# EAGLE design msp430g2955 (EAGLE 7.3.0)
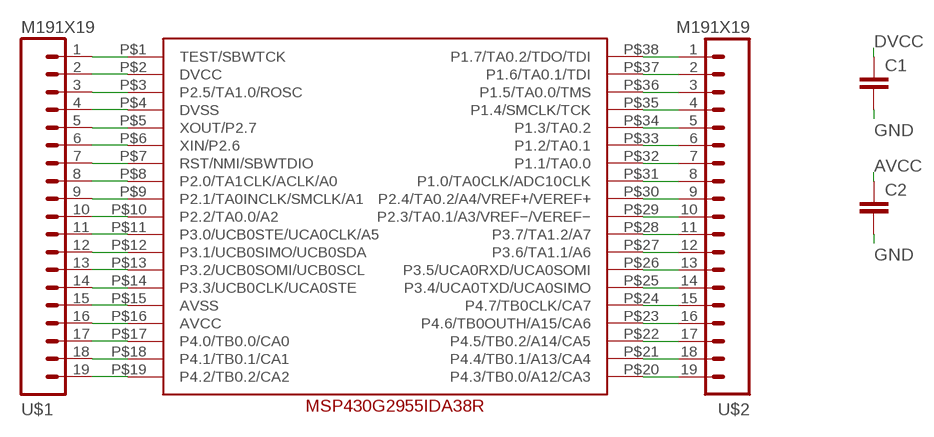
[diagram p0: schematic, sheet 1]

## Parts
C1  C-EUC0805  [C0805]
C2  C-EUC0805  [C0805]
U$1  M191X19  [1X19]
U$2  M191X19  [1X19]
U$3  MSP430G2955IDA38R  [MSP430G2955IDA38R]

## Nets
AVCC: C2.1 U$1.16 U$3.P$16(AVCC)
DVCC: C1.1 U$1.2 U$3.P$2(DVCC)
GND: C1.2 C2.2 U$1.4 U$1.15 U$3.P$4(DVSS) U$3.P$15(AVSS)
N$1: U$1.1 U$3.P$1(TEST/SBWTCK)
N$3: U$1.3 U$3.P$3(P2.5/TA1.0/ROSC)
N$5: U$1.5 U$3.P$5(XOUT/P2.7)
N$6: U$1.6 U$3.P$6(XIN/P2.6)
N$7: U$1.7 U$3.P$7(RST/NMI/SBWTDIO)
N$8: U$1.8 U$3.P$8(P2.0/TA1CLK/ACLK/A0)
N$9: U$1.9 U$3.P$9(P2.1/TA0INCLK/SMCLK/A1)
N$10: U$1.10 U$3.P$10(P2.2/TA0.0/A2)
N$11: U$1.11 U$3.P$11(P3.0/UCB0STE/UCA0CLK/A5)
N$12: U$1.12 U$3.P$12(P3.1/UCB0SIMO/UCB0SDA)
N$13: U$1.13 U$3.P$13(P3.2/UCB0SOMI/UCB0SCL)
N$14: U$1.14 U$3.P$14(P3.3/UCB0CLK/UCA0STE)
N$17: U$1.17 U$3.P$17(P4.0/TB0.0/CA0)
N$18: U$1.18 U$3.P$18(P4.1/TB0.1/CA1)
N$19: U$1.19 U$3.P$19(P4.2/TB0.2/CA2)
N$20: U$2.19 U$3.P$20(P4.3/TB0.0/A12/CA3)
N$21: U$2.18 U$3.P$21(P4.4/TB0.1/A13/CA4)
N$22: U$2.17 U$3.P$22(P4.5/TB0.2/A14/CA5)
N$23: U$2.16 U$3.P$23(P4.6/TB0OUTH/A15/CA6)
N$24: U$2.15 U$3.P$24(P4.7/TB0CLK/CA7)
N$25: U$2.14 U$3.P$25(P3.4/UCA0TXD/UCA0SIMO)
N$26: U$2.13 U$3.P$26(P3.5/UCA0RXD/UCA0SOMI)
N$27: U$2.12 U$3.P$27(P3.6/TA1.1/A6)
N$28: U$2.11 U$3.P$28(P3.7/TA1.2/A7)
N$29: U$2.10 U$3.P$29(P2.3/TA0.1/A3/VREF−/VEREF−)
N$30: U$2.9 U$3.P$30(P2.4/TA0.2/A4/VREF+/VEREF+)
N$31: U$2.8 U$3.P$31(P1.0/TA0CLK/ADC10CLK)
N$32: U$2.7 U$3.P$32(P1.1/TA0.0)
N$33: U$2.6 U$3.P$33(P1.2/TA0.1)
N$34: U$2.5 U$3.P$34(P1.3/TA0.2)
N$35: U$2.4 U$3.P$35(P1.4/SMCLK/TCK)
N$36: U$2.3 U$3.P$36(P1.5/TA0.0/TMS)
N$37: U$2.2 U$3.P$37(P1.6/TA0.1/TDI)
N$38: U$2.1 U$3.P$38(P1.7/TA0.2/TDO/TDI)

## Library data of the parts
C1 C2 = rcl:C-EU: CAPACITOR, European symbol
U$1 U$2 = SparkFun-Connectors:M19: 1x19 .1" header
U$3 = MSP430G2955:MSP430G2955IDA38R

## Board
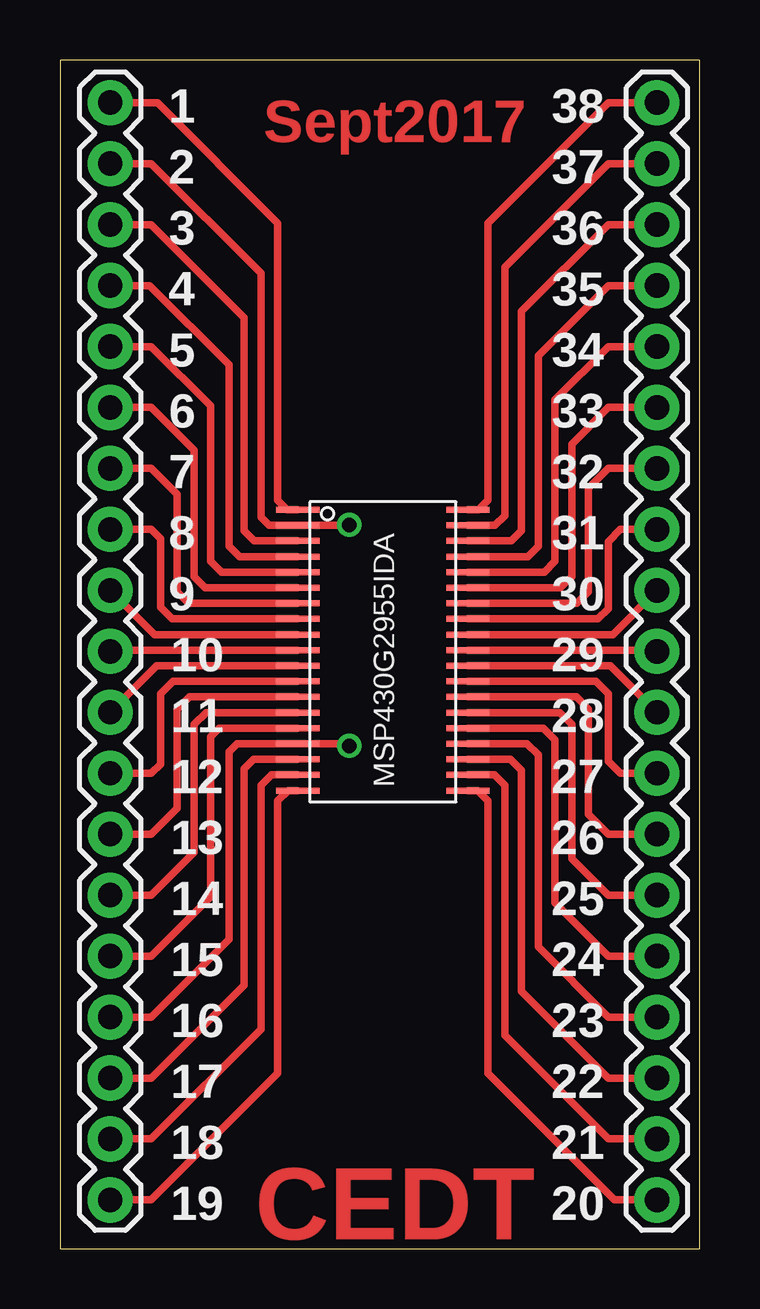
[diagram p1: board, top side]
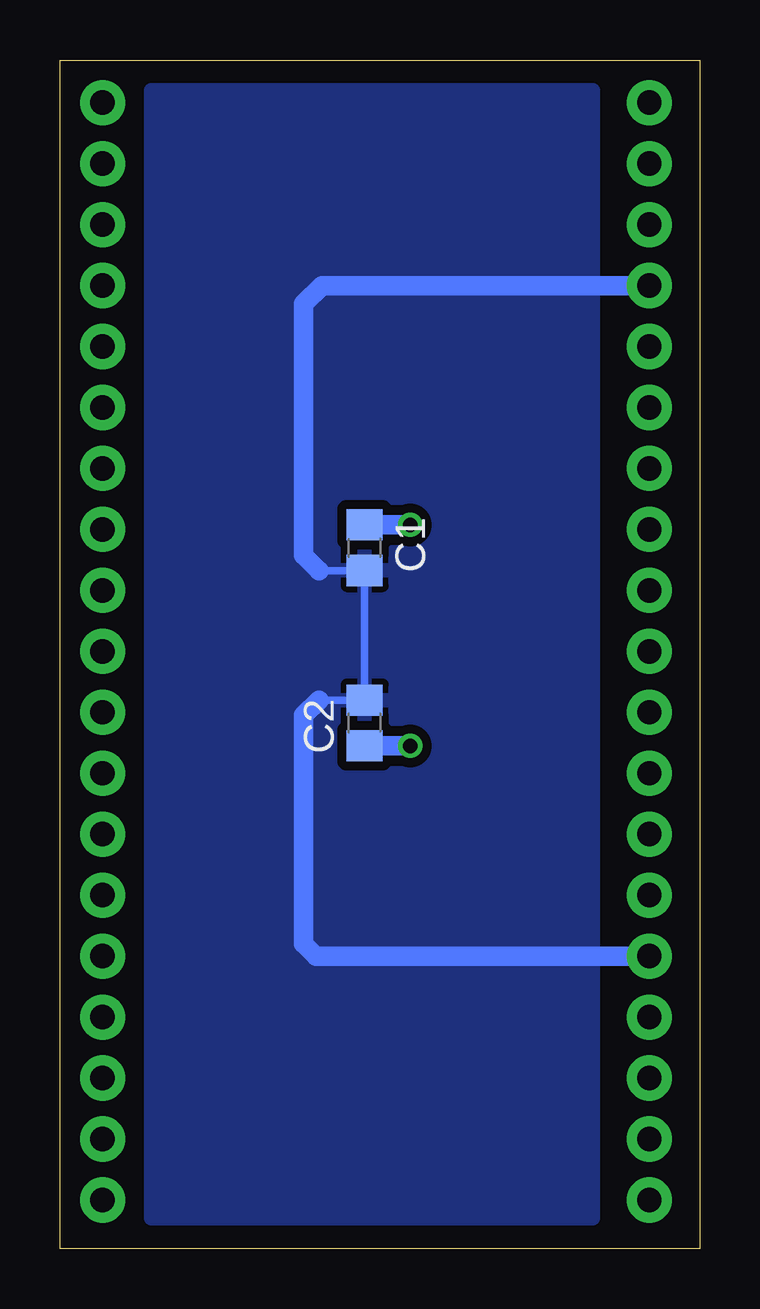
[diagram p2: board, bottom side, seen from below]

Size 26.67 x 49.53 mm. Coordinates in mm from the lower left corner, seen from the top.
Outline: 0,0 26.67,0 26.67,49.53 0,49.53 0,0
Copper layers (1*16): Top 0.035mm / dielectric 1.5mm / Bottom 0.035mm
Design rules "default *": minimum track width 10mil, minimum drill 16mil, track to track 10mil, track to pad 10mil, pad to pad 10mil, via to via 10mil, smd to smd 10mil, copper to edge 10mil, drill to drill 8mil, minimum pad ring 10mil, minimum via ring 8mil, stop-mask expansion 4mil, vias tented up to drill 20mil, thermal gap 10mil

### Footprints (pad centres in the part's own frame; a part is rotated, then mirrored left to right if it is on the bottom)
C0805 = smd 1.3 x 1.5: 1 -0.95,0; 2 0.95,0
1X19 = drill 1.016 pad 1.88: 1 0,0; 2 2.54,0; 3 5.08,0; 4 7.62,0; 5 10.16,0; 6 12.7,0; 7 15.24,0; 8 17.78,0; 9 20.32,0; 10 22.86,0; 11 25.4,0; 12 27.94,0; 13 30.48,0; 14 33.02,0; 15 35.56,0; 16 38.1,0; 17 40.64,0; 18 43.18,0; 19 45.72,0
MSP430G2955IDA38R = smd 0.25 x 1.8: P$1 -6.025,-3.04; P$2 -5.375,-3.04; P$3 -4.725,-3.04; P$4 -4.075,-3.04; P$5 -3.425,-3.04; P$6 -2.775,-3.04; P$7 -2.125,-3.04; P$8 -1.475,-3.04; P$9 -0.825,-3.04; P$10 -0.175,-3.04; P$11 0.475,-3.04; P$12 1.125,-3.04; P$13 1.775,-3.04; P$14 2.425,-3.04; P$15 3.075,-3.04; P$16 3.725,-3.04; P$17 4.375,-3.04; P$18 5.025,-3.04; P$19 5.675,-3.04; P$20 5.675,4.06; P$21 5.025,4.06; P$22 4.375,4.06; P$23 3.725,4.06; P$24 3.075,4.06; P$25 2.425,4.06; P$26 1.775,4.06; P$27 1.125,4.06; P$28 0.475,4.06; P$29 -0.175,4.06; P$30 -0.825,4.06; P$31 -1.475,4.06; P$32 -2.125,4.06; P$33 -2.775,4.06; P$34 -3.425,4.06; P$35 -4.075,4.06; P$36 -4.725,4.06; P$37 -5.375,4.06; P$38 -6.025,4.06

### Placement (x,y rotation side)
C1  13.97,29.21 270 bottom
C2  13.97,21.91 90 bottom
U$1  2.1,47.75 270 top
U$2  24.89,47.75 270 top
U$3  12.95,24.77 270 top

### Tracks (layer width: path | path; a pad name or v marks a point on that pad's centre or on a via)
AVCC  (via drill 0.6)
  Top 0.305: U$1.16 3.81,9.65 7.05,12.89 7.05,20.7 7.39,21.04 U$3.P$16 11.98,21.04 v12.06,20.95
  Bottom 0.305: C2.1
  Bottom 0.813: v12.06,20.95 C2.1
DVCC  (via drill 0.6)
  Top 0.305: U$1.2 3.81,45.21 8.38,40.64 8.38,30.48 8.72,30.14 U$3.P$2 12.04,30.14 v12.06,30.16
  Bottom 0.305: 13.33,30.16 C1.1
  Bottom 0.813: v12.06,30.16 13.33,30.16
GND
  Top 0.305: U$3.P$4 7.48,28.84 7.05,29.27 7.05,36.83 3.75,40.13 U$1.4 | U$3.P$15 6.64,21.69 6.29,21.34 6.29,14.67 3.81,12.19 U$1.15
  Bottom 0.305: 15.88,28.26 C1.2 | C1.2 | 15.88,22.86 C2.2 | C1.2 C2.2 | C2.2
  Bottom 0.813: U$1.4 15.75,40.13 16.51,39.37 16.51,28.89 15.88,28.26 | U$1.15 16,12.19 16.51,12.7 16.51,22.23 15.88,22.86
  pour Bottom (isolate 0.381): 4.45,48.26 22.86,48.26 22.86,1.27 4.45,1.27
N$1
  Top 0.305: U$3.P$1 9.47,30.79 9.08,31.18 9.08,42.74 4.06,47.75 U$1.1
N$3
  Top 0.305: U$3.P$3 8.1,29.49 7.68,29.91 7.68,38.8 3.81,42.67 U$1.3
N$5
  Top 0.305: U$3.P$5 6.74,28.19 6.29,28.64 6.29,35.12 3.81,37.59 U$1.5
N$6
  Top 0.305: U$3.P$6 6.05,27.54 5.59,28 5.59,33.27 3.81,35.05 U$1.6
N$7
  Top 0.305: U$3.P$7 5.37,26.89 4.89,27.37 4.89,31.43 3.81,32.51 U$1.7
N$8
  Top 0.305: U$3.P$8 4.68,26.24 4.19,26.73 4.19,29.59 3.81,29.97 U$1.8
N$9
  Top 0.305: U$3.P$9 3.94,25.59 U$1.9
N$10
  Top 0.305: U$3.P$10 2.14,24.94 U$1.10
N$11
  Top 0.305: U$3.P$11 4.03,24.29 U$1.11
N$12
  Top 0.305: U$3.P$12 4.72,23.64 4.19,23.11 4.19,20.19 3.81,19.81 U$1.12
N$13
  Top 0.305: U$3.P$13 5.4,22.99 4.89,22.48 4.89,18.35 3.81,17.27 U$1.13
N$14
  Top 0.305: U$3.P$14 6.08,22.34 5.59,21.84 5.59,16.51 3.81,14.73 U$1.14
N$17
  Top 0.305: U$3.P$17 8.07,20.39 7.68,20 7.68,10.99 3.81,7.11 U$1.17
N$18
  Top 0.305: U$3.P$18 8.82,19.74 8.38,19.3 8.38,9.14 3.81,4.57 U$1.18
N$19
  Top 0.305: U$3.P$19 9.5,19.09 9.08,18.67 9.08,7.3 3.81,2.03 U$1.19
N$20
  Top 0.305: U$3.P$20 17.42,19.09 17.84,18.67 17.84,7.3 23.11,2.03 U$2.19
N$21
  Top 0.305: U$3.P$21 18.11,19.74 18.54,19.3 18.54,8.89 22.86,4.57 U$2.18
N$22
  Top 0.305: U$3.P$22 18.79,20.39 19.24,19.94 19.24,10.73 22.86,7.11 U$2.17
N$23
  Top 0.305: U$3.P$23 19.47,21.04 19.94,20.57 19.94,12.57 22.86,9.65 U$2.16
N$24
  Top 0.305: U$3.P$24 20.16,21.69 20.64,21.21 20.64,14.41 22.86,12.19 U$2.15
N$25
  Top 0.305: U$3.P$25 20.84,22.34 21.34,21.84 21.34,16.26 22.86,14.73 U$2.14
N$26
  Top 0.305: U$3.P$26 21.52,22.99 22.04,22.48 22.04,18.1 22.86,17.27 U$2.13
N$27
  Top 0.305: U$3.P$27 22.33,23.64 22.86,23.11 22.86,20.32 23.37,19.81 U$2.12
N$28
  Top 0.305: U$3.P$28 22.95,24.29 U$2.11
N$29
  Top 0.305: U$3.P$29 24.84,24.94 U$2.10
N$30
  Top 0.305: U$3.P$30 23.05,25.59 U$2.9
N$31
  Top 0.305: U$3.P$31 22.43,26.24 22.86,26.67 22.86,29.46 23.37,29.97 U$2.8
N$32
  Top 0.305: U$3.P$32 21.56,26.89 22.04,27.37 22.04,31.69 22.86,32.51 U$2.7
N$33
  Top 0.305: U$3.P$33 20.87,27.54 21.34,28 21.34,33.53 22.86,35.05 U$2.6
N$34
  Top 0.305: U$3.P$34 20.19,28.19 20.64,28.64 20.64,35.37 22.86,37.59 U$2.5
N$35
  Top 0.305: U$3.P$35 19.51,28.84 19.94,29.27 19.94,37.21 22.86,40.13 U$2.4
N$36
  Top 0.305: U$3.P$36 18.82,29.49 19.24,29.91 19.24,39.05 22.86,42.67 U$2.3
N$37
  Top 0.305: U$3.P$37 18.14,30.14 18.54,30.54 18.54,40.89 22.86,45.21 U$2.2
N$38
  Top 0.305: U$3.P$38 17.45,30.79 17.84,31.18 17.84,42.74 22.86,47.75 U$2.1

### Text on the board
Top: Sept2017 | CEDT
tPlace: 1 | 38 | 2 | 37 | 3 | 36 | 4 | 35 | 5 | 34 | 6 | 33 | 7 | 32 | 8 | 31 | 9 | 30 | 10 | 29 | 11 | 28 | 12 | 27 | 13 | 26 | 14 | 25 | 15 | 24 | 16 | 23 | 17 | 22 | 18 | 21 | 19 | 20
tStop: Sept2017 | CEDT